# Altium schematic sheet main.SchDoc
size 250 x 180 mm
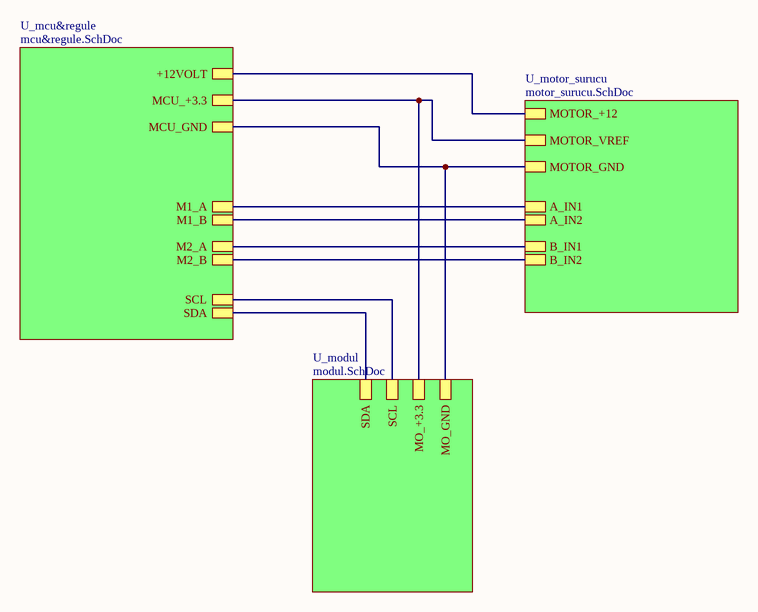
[diagram p0: main.SchDoc]

## Sub-sheets
U_mcu&regule = mcu&regule.SchDoc: +12VOLT, M1_A, M1_B, M2_A, M2_B, MCU_GND, MCU_+3.3, SCL, SDA
U_modul = modul.SchDoc: MO_GND, MO_+3.3, SCL, SDA
U_motor_surucu = motor_surucu.SchDoc: MOTOR_GND, MOTOR_+12, MOTOR_VREF, A_IN1, A_IN2, B_IN1, B_IN2

## Nets
(unnamed): sheet U_mcu&regule/+12VOLT, sheet U_motor_surucu/MOTOR_+12
(unnamed): sheet U_mcu&regule/M1_A, sheet U_motor_surucu/A_IN1
(unnamed): sheet U_mcu&regule/M1_B, sheet U_motor_surucu/A_IN2
(unnamed): sheet U_mcu&regule/M2_A, sheet U_motor_surucu/B_IN1
(unnamed): sheet U_mcu&regule/M2_B, sheet U_motor_surucu/B_IN2
(unnamed): sheet U_mcu&regule/MCU_GND, sheet U_modul/MO_GND, sheet U_motor_surucu/MOTOR_GND
(unnamed): sheet U_mcu&regule/MCU_+3.3, sheet U_modul/MO_+3.3, sheet U_motor_surucu/MOTOR_VREF
(unnamed): sheet U_mcu&regule/SCL, sheet U_modul/SCL
(unnamed): sheet U_mcu&regule/SDA, sheet U_modul/SDA